# Altium schematic sheet BattleBoardRev3.SchDoc
size Letter; Date: 3/31/2017; DrawnBy: David Ridley; ProjectName: BattleBoard
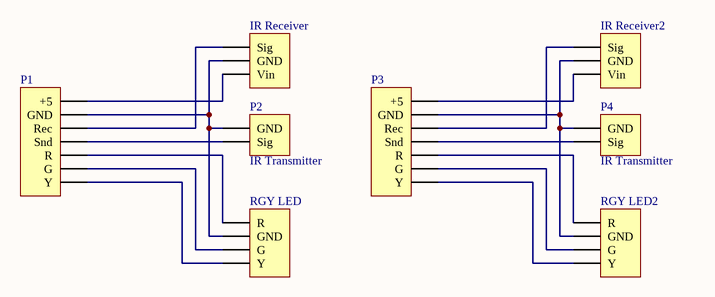
[diagram p0: BattleBoardRev3.SchDoc]

## Parts
IR_Receiver  Header 3  [HDR1X3]  (value not drawn)
IR_Receiver2  Header 3  [HDR1X3]  (value not drawn)
P1  Header 7  [HDR1X7]  (value not drawn)
P2  IR Transmitter  [HDR1X2]
P3  Header 7  [HDR1X7]  (value not drawn)
P4  IR Transmitter  [HDR1X2]
RGY_LED  Header 4  [HDR1X4]  (value not drawn)
RGY_LED2  Header 4  [HDR1X4]  (value not drawn)

## Nets
NetIR_Receiver2_1: IR_Receiver2.1(Sig) P3.5(Rec)
NetIR_Receiver2_2: IR_Receiver2.2(GND) P3.6(GND) P4.1(GND) RGY_LED2.2(GND)
NetIR_Receiver2_3: IR_Receiver2.3(Vin) P3.7(+5)
NetIR_Receiver_1: IR_Receiver.1(Sig) P1.5(Rec)
NetIR_Receiver_2: IR_Receiver.2(GND) P1.6(GND) P2.1(GND) RGY_LED.2(GND)
NetIR_Receiver_3: IR_Receiver.3(Vin) P1.7(+5)
NetP1_1: P1.1(Y) RGY_LED.4(Y)
NetP1_2: P1.2(G) RGY_LED.3(G)
NetP1_3: P1.3(R) RGY_LED.1(R)
NetP1_4: P1.4(Snd) P2.2(Sig)
NetP3_1: P3.1(Y) RGY_LED2.4(Y)
NetP3_2: P3.2(G) RGY_LED2.3(G)
NetP3_3: P3.3(R) RGY_LED2.1(R)
NetP3_4: P3.4(Snd) P4.2(Sig)

## Library data of the parts
IR_Receiver IR_Receiver2 = Header 3: Header, 3-Pin; LatestRevisionDate: 17-Jul-2002; LatestRevisionNote: Re-released for DXP Platform.; Publisher: Altium Limited
P1 P3 = Header 7: Header, 7-Pin; LatestRevisionDate: 17-Jul-2002; LatestRevisionNote: Re-released for DXP Platform.; Publisher: Altium Limited
P2 P4 = Header 2: Header, 2-Pin; LatestRevisionDate: 17-Jul-2002; LatestRevisionNote: Re-released for DXP Platform.; Publisher: Altium Limited
RGY_LED RGY_LED2 = Header 4: Header, 4-Pin; LatestRevisionDate: 17-Jul-2002; LatestRevisionNote: Re-released for DXP Platform.; Publisher: Altium Limited